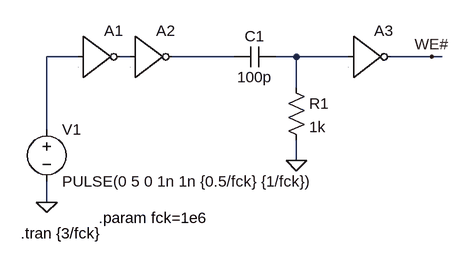
[diagram p0: schematic WE.asc]
WE.asc, the LTspice schematic file:
Version 4.1
SHEET 1 880 680
WIRE 112 48 64 48
WIRE 192 48 176 48
WIRE 352 48 256 48
WIRE 448 48 416 48
WIRE 528 48 448 48
WIRE 656 48 592 48
WIRE 672 48 656 48
WIRE 448 96 448 48
WIRE 64 160 64 48
WIRE 448 208 448 176
WIRE 64 272 64 240
FLAG 64 272 0
FLAG 448 208 0
FLAG 656 48 WE#
SYMBOL voltage 64 144 R0
WINDOW 123 0 0 Left 0
WINDOW 39 0 0 Left 0
SYMATTR InstName V1
SYMATTR Value PULSE(0 5 0 1n 1n {0.5/fck} {1/fck})
SYMBOL res 432 80 R0
SYMATTR InstName R1
SYMATTR Value 1k
SYMBOL cap 416 32 R90
WINDOW 0 0 32 VBottom 2
WINDOW 3 32 32 VTop 2
SYMATTR InstName C1
SYMATTR Value 100p
SYMBOL Digital\\inv 112 -16 R0
WINDOW 3 8 60 Invisible 2
SYMATTR InstName A1
SYMATTR Value Vhigh=5 td=5n
SYMBOL Digital\\inv 192 -16 R0
WINDOW 3 8 60 Invisible 2
SYMATTR InstName A2
SYMATTR Value Vhigh=5 td=5n
SYMBOL Digital\\inv 528 -16 R0
WINDOW 3 8 60 Invisible 2
SYMATTR InstName A3
SYMATTR Value Vhigh=5 td=5n
TEXT 144 296 Left 2 !.param fck=1e6
TEXT 24 320 Left 2 !.tran {3/fck}

The netlist it stands for:
* WE.asc
V1 N001 0 PULSE(0 5 0 1n 1n {0.5/fck} {1/fck})
R1 N004 0 1k
C1 N004 N003 100p
A1 N001 0 0 0 0 N002 0 0 BUF Vhigh=5 td=5n
A2 N002 0 0 0 0 N003 0 0 BUF Vhigh=5 td=5n
A3 N004 0 0 0 0 WE# 0 0 BUF Vhigh=5 td=5n
.param fck=1e6
.tran {3/fck}
.backanno
.end